# Altium schematic sheet LDO.SchDoc
size A4
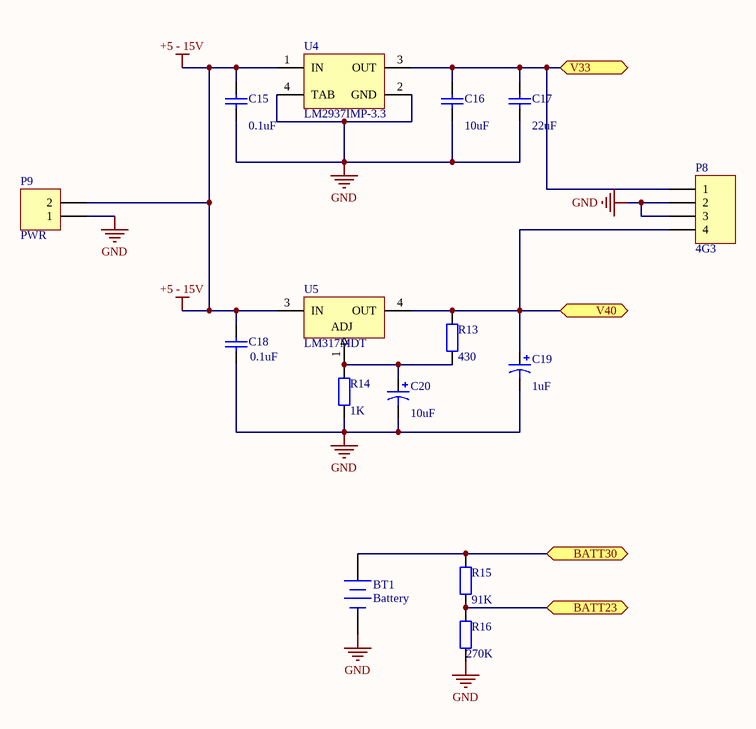
[diagram p0: LDO.SchDoc]

## Parts
BT1  Battery  [Edge Connector]
C15  value 0.1uF  [RAD-0.1]  (hidden comment: Cap)
C16  value 10uF  [R38]  (hidden comment: Cap)
C17  value 22uF  [R38]  (hidden comment: Cap)
C18  value 0.1uF  [RAD-0.1]  (hidden comment: Cap)
C19  value 1uF  [R38]  (hidden comment: Cap Pol1)
C20  value 10uF  [R38]  (hidden comment: Cap Pol1)
P8  4G3  [HDR1X4]
P9  PWR  [HDR1X2H]
R13  value 430  [AXIAL-0.4]  (hidden comment: Res2)
R14  value 1K  [AXIAL-0.4]  (hidden comment: Res2)
R15  value 91K  [AXIAL-0.4]  (hidden comment: Res2)
R16  value 270K  [AXIAL-0.4]  (hidden comment: Res2)
U4  LM2937IMP-3.3  [MP04A_N]
U5  LM317MDT  [TD03B_N]

## Ports
BATT23, BATT30, V33, V40

## Nets
+5 - 15V: C15.2 C18.2 P9.2 U4.1(IN) U5.3(IN)
GND: BT1.2(-) C15.1 C16.1 C17.1 C18.1 C19.2 C20.2 P8.2 P8.3 P9.1 R14.1 R16.1 U4.2(GND) U4.4(TAB)
BATT23: R15.1 R16.2 ; port BATT23
BATT30: BT1.1(+) R15.2 ; port BATT30
V33: C16.2 C17.2 P8.1 U4.3(OUT) ; port V33
V40: C19.1 P8.4 R13.2 U5.4(OUT) ; port V40
NetC20_1: C20.1 R13.1 R14.2 U5.1(ADJ)

## Library data of the parts
BT1 = Battery: Multicell Battery; Published: 24-Mar-1999; LatestRevisionDate: 17-Jul-2002; LatestRevisionNote: Re-released for DXP Platform.; PackageReference: BAT-2; Publisher: Altium Limited; PackageDescription: Battery; 2 Leads
C15-C18 = Cap: Capacitor; Published: 8-Jun-2000; LatestRevisionDate: 17-Jul-2002; LatestRevisionNote: Re-released for DXP Platform.; PackageReference: RAD-0.3; Publisher: Altium Limited; PackageDescription: Radial Cap, Thru-Hole; 2 Leads; 0.3 in Pin Spacing
C19 C20 = Cap Pol1: Polarized Capacitor (Radial); Published: 8-Jun-2000; LatestRevisionDate: 17-Jul-2002; LatestRevisionNote: Re-released for DXP Platform.; PackageReference: RB7.6-15; Publisher: Altium Limited; PackageDescription: Polarized Capacitor (Radial); 2 Leads
P8 = Header 4H: Header, 4-Pin, Right Angle; LatestRevisionDate: 17-Jul-2002; LatestRevisionNote: Re-released for DXP Platform.; Publisher: Altium Limited
P9 = Header 2H: Header, 2-Pin, Right Angle; LatestRevisionDate: 17-Jul-2002; LatestRevisionNote: Re-released for DXP Platform.; Publisher: Altium Limited
R13-R16 = Res2: Resistor; Published: 8-Jun-2000; LatestRevisionDate: 17-Jul-2002; LatestRevisionNote: Re-released for DXP Platform.; PackageReference: AXIAL-0.4; Publisher: Altium Limited; PackageDescription: Axial Device, Thru-Hole; 2 Leads; 0.4 in Pin Spacing
U4 = LM2937IMP-3.3: 500 mA Low Dropout Regulator; Manufacturer: National Semiconductor; CompType: LDO IC; PackageTopMarking: XYTT*L69B; PowerWise: N; Published: 4-Dec-2008; DatasheetVersion: Aug-2005; PackageVersion: revB, Apr-2003; PackageReference: MP04A; Publisher: Altium Limited; PackageDescription: Molded SOT-223, 6.50 x 3.56 x 1.6mm Body, 4 Lead, 2.3mm Pitch; PartNumber: LM2937IMP-3.3; RoHS: O; PinCount: 4; DigiKeyPartNumber: LM2937IMP-3.3CT-ND; Code_JEDEC: TO-261-AA; Code_IPC: SOT223-4; ComponentLink1Description: LM2937-3.3 Datasheet; ComponentLink1URL: http://www.national.com/ds/LM/LM2937-3.3.pdf; ComponentLink2Description: LM2937-3.3 Web Page; ComponentLink2URL: http://www.national.com/pf/LM/LM2937-3.3.html; ComponentLink3Description: MP04A Package Page; ComponentLink3URL: http://www.national.com/packaging/folders/mp04a.html
U5 = LM317MDT: 3-Terminal Adjustable Regulator; Manufacturer: National Semiconductor; CompType: LDO IC; PackageTopMarking: NSUZXYTT*LM317*MDT; PowerWise: N; Published: 4-Dec-2008; DatasheetVersion: Apr-2007; PackageVersion: revC, Apr-2003; PackageReference: TD03B; Publisher: Altium Limited; PackageDescription: TO252, Molded, Jedec, 6.8 x 6.10 x 2.30mm Body, 3 Lead, 2.28mm Pitch, Surface Mount; PartNumber: LM317MDT; RoHS: O; PinCount: 3; DigiKeyPartNumber: LM317MDTNS-ND; Code_JEDEC: TO-252-AA; ComponentLink1Description: LM317 Datasheet; ComponentLink1URL: http://www.national.com/ds/LM/LM317.pdf; ComponentLink2Description: LM317 Web Page; ComponentLink2URL: http://www.national.com/pf/LM/LM317.html; ComponentLink3Description: TD03B Package Page; ComponentLink3URL: http://www.national.com/packaging/folders/td03b.html